# Altium schematic sheet Análisis_punto_DC.SchDoc
size Letter; Author: Pablo F. Moreno L.; SheetNumber: 1
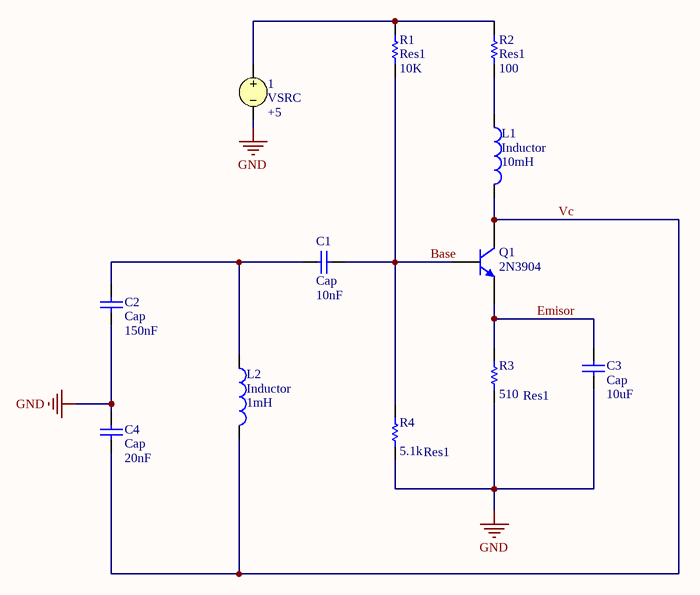
[diagram p0: Análisis_punto_DC.SchDoc]

## Parts
1  VSRC  value +5
C1  Cap  value 10nF  [RAD-0.3]
C2  Cap  value 150nF  [RAD-0.3]
C3  Cap  value 10uF  [RAD-0.3]
C4  Cap  value 20nF  [RAD-0.3]
L1  Inductor  value 10mH  [0402-A]
L2  Inductor  value 1mH  [0402-A]
Q1  2N3904  [TO-92A]
R1  Res1  value 10K  [AXIAL-0.3]
R2  Res1  value 100  [AXIAL-0.3]
R3  Res1  value 510  [AXIAL-0.3]
R4  Res1  value 5.1k  [AXIAL-0.3]

## Nets
GND: 1.2 C2.1 C3.1 C4.2 R3.1 R4.1
Base: C1.1 Q1.2(B) R1.1 R4.2
Emisor: C3.2 Q1.1(E) R3.2
Vc: C4.1 L1.2 L2.2 Q1.3(C)
Net1_1: 1.1 R1.2 R2.2
NetC1_2: C1.2 C2.2 L2.1
NetL1_1: L1.1 R2.1

## Notes on the sheet
- Project:
- Page content:
- Size:
- Revisión
- Letter
- Document Number
- Design:
- Date:
- Sheet:
- of

## Library data of the parts
1 = VSRC: Voltage Source; Note: PCB Footprint - Not required; Published: 8-Jun-2000; LatestRevisionDate: 17-Jul-2002; LatestRevisionNote: Re-released for DXP Platform.; PackageReference: Not Applicable; Publisher: Altium Limited
C1-C4 = Cap: Capacitor; Published: 8-Jun-2000; LatestRevisionDate: 17-Jul-2002; LatestRevisionNote: Re-released for DXP Platform.; PackageReference: RAD-0.3; Publisher: Altium Limited; PackageDescription: Radial Cap, Thru-Hole; 2 Leads; 0.3 in Pin Spacing
L1 L2 = Inductor: Code_IEC: 1005; Published: 8-Jun-2000; LatestRevisionDate: 29-May-2009; LatestRevisionNote: IPC-7351 Footprint Added.; PackageReference: 0402-A; Publisher: Altium Limited; PackageDescription: Chip Inductor; Code_JEITA: 0402
Q1 = 2N3904: NPN General Purpose Amplifier; Published: 8-Jun-2000; LatestRevisionDate: 15-Jan-2003; LatestRevisionNote: PCB Footprint 'BCY-W3/D4.7' replaced; DatasheetVersion: 1997; PackageVersion: Sep-1998; PackageReference: TO-92A; Publisher: Altium Limited; PackageDescription: TO, Flat Index; 3 In-Line, Axial Leads; Body Dia. 4.5mm; Leads 0.51 x 0.48 mm (max); ComponentLink1Description: Manufacturer Link; ComponentLink1URL: http://www.fairchildsemi.com/; ComponentLink2Description: Datasheet; ComponentLink2URL: http://www.fairchildsemi.com/ds/2N%2F2N3904.pdf
R1-R4 = Res1: Resistor; Published: 8-Jun-2000; LatestRevisionDate: 17-Jul-2002; LatestRevisionNote: Re-released for DXP Platform.; PackageReference: AXIAL-0.3; Publisher: Altium Limited; PackageDescription: Axial Device, Thru-Hole; 2 Leads; 0.3 in Pin Spacing